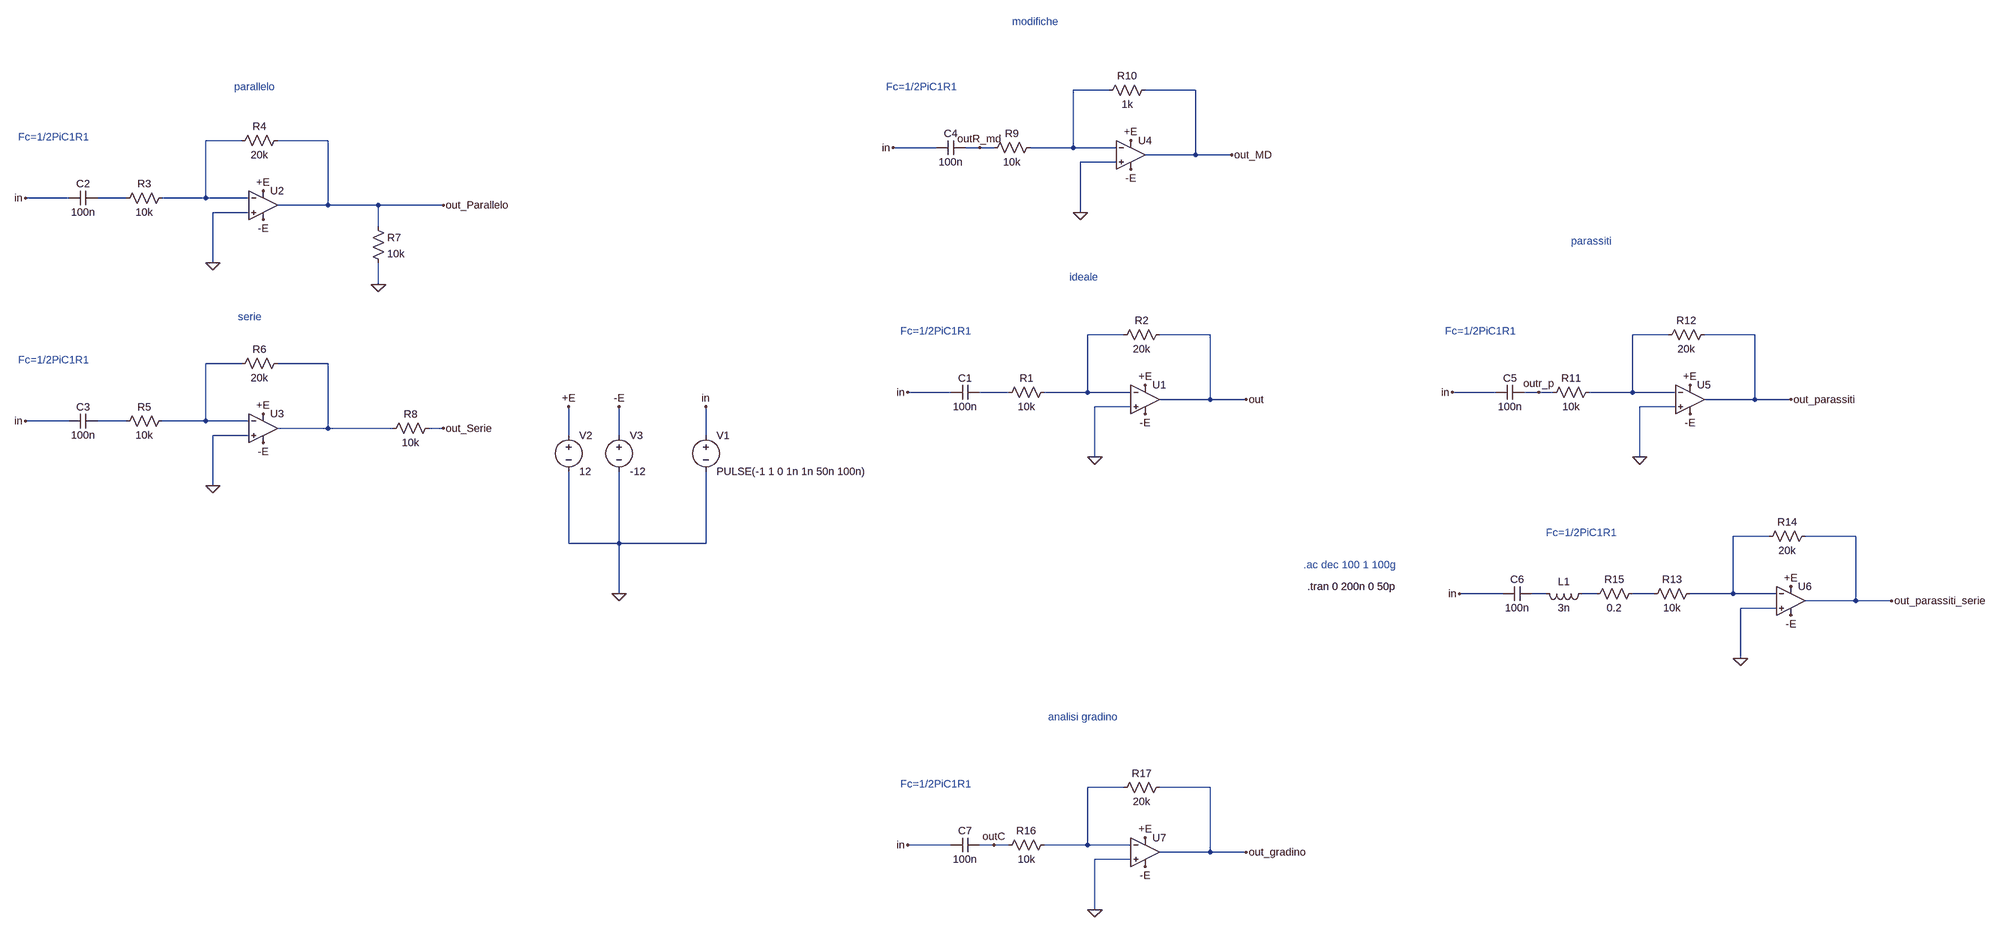
[diagram p0: schematic attivo-ideale.asc]
attivo-ideale.asc, the LTspice schematic file:
Version 4.1
SHEET 1 3920 1460
WIRE 1840 -448 1760 -448
WIRE 2032 -448 1920 -448
WIRE -576 -336 -656 -336
WIRE -384 -336 -496 -336
WIRE 1456 -320 1360 -320
WIRE 1552 -320 1520 -320
WIRE 1584 -320 1552 -320
WIRE 1760 -320 1760 -448
WIRE 1760 -320 1664 -320
WIRE 1856 -320 1760 -320
WIRE 2032 -304 2032 -448
WIRE 2032 -304 1920 -304
WIRE 2112 -304 2032 -304
WIRE 1856 -288 1776 -288
WIRE -960 -208 -1056 -208
WIRE -832 -208 -896 -208
WIRE -656 -208 -656 -336
WIRE -656 -208 -752 -208
WIRE -560 -208 -656 -208
WIRE -384 -192 -384 -336
WIRE -384 -192 -496 -192
WIRE -272 -192 -384 -192
WIRE -128 -192 -272 -192
WIRE -560 -176 -640 -176
WIRE 1776 -176 1776 -288
WIRE -272 -144 -272 -192
WIRE -640 -64 -640 -176
WIRE -272 -16 -272 -64
WIRE 1872 96 1792 96
WIRE 2064 96 1952 96
WIRE 3184 96 3104 96
WIRE 3376 96 3264 96
WIRE -576 160 -656 160
WIRE -384 160 -496 160
WIRE 1488 224 1392 224
WIRE 1616 224 1552 224
WIRE 1792 224 1792 96
WIRE 1792 224 1696 224
WIRE 1888 224 1792 224
WIRE 2800 224 2704 224
WIRE 2896 224 2864 224
WIRE 2928 224 2896 224
WIRE 3104 224 3104 96
WIRE 3104 224 3008 224
WIRE 3200 224 3104 224
WIRE 2064 240 2064 96
WIRE 2064 240 1952 240
WIRE 2144 240 2064 240
WIRE 3376 240 3376 96
WIRE 3376 240 3264 240
WIRE 3456 240 3376 240
WIRE 1888 256 1808 256
WIRE 3200 256 3120 256
WIRE -960 288 -1056 288
WIRE -832 288 -896 288
WIRE -656 288 -656 160
WIRE -656 288 -752 288
WIRE -560 288 -656 288
WIRE -384 304 -384 160
WIRE -384 304 -496 304
WIRE -240 304 -384 304
WIRE -128 304 -160 304
WIRE -560 320 -640 320
WIRE 544 320 544 256
WIRE 656 320 656 256
WIRE 944 320 944 256
WIRE 1808 368 1808 256
WIRE 3120 368 3120 256
WIRE -640 432 -640 320
WIRE 3408 544 3328 544
WIRE 3600 544 3488 544
WIRE 544 560 544 400
WIRE 656 560 656 400
WIRE 656 560 544 560
WIRE 944 560 944 400
WIRE 944 560 656 560
WIRE 656 672 656 560
WIRE 2816 672 2720 672
WIRE 2912 672 2880 672
WIRE 3024 672 2992 672
WIRE 3152 672 3104 672
WIRE 3328 672 3328 544
WIRE 3328 672 3232 672
WIRE 3424 672 3328 672
WIRE 3600 688 3600 544
WIRE 3600 688 3488 688
WIRE 3680 688 3600 688
WIRE 3424 704 3344 704
WIRE 3344 816 3344 704
WIRE 1872 1168 1792 1168
WIRE 2064 1168 1952 1168
WIRE 1488 1296 1392 1296
WIRE 1584 1296 1552 1296
WIRE 1616 1296 1584 1296
WIRE 1792 1296 1792 1168
WIRE 1792 1296 1696 1296
WIRE 1888 1296 1792 1296
WIRE 2064 1312 2064 1168
WIRE 2064 1312 1952 1312
WIRE 2144 1312 2064 1312
WIRE 1888 1328 1808 1328
WIRE 1808 1440 1808 1328
FLAG 544 256 +E
FLAG 656 256 -E
FLAG 944 256 in
FLAG 1808 368 0
FLAG 1920 208 +E
FLAG 1920 272 -E
FLAG 2144 240 out
FLAG 1392 224 in
FLAG 656 672 0
FLAG -640 -64 0
FLAG -528 -224 +E
FLAG -528 -160 -E
FLAG -1056 -208 in
FLAG -640 432 0
FLAG -528 272 +E
FLAG -528 336 -E
FLAG -1056 288 in
FLAG -272 -16 0
FLAG -128 -192 out_Parallelo
FLAG -128 304 out_Serie
FLAG 1776 -176 0
FLAG 1888 -336 +E
FLAG 1888 -272 -E
FLAG 2112 -304 out_MD
FLAG 1360 -320 in
FLAG 3120 368 0
FLAG 3232 208 +E
FLAG 3232 272 -E
FLAG 3456 240 out_parassiti
FLAG 2704 224 in
FLAG 3344 816 0
FLAG 3456 656 +E
FLAG 3456 720 -E
FLAG 3680 688 out_parassiti_serie
FLAG 2720 672 in
FLAG 1808 1440 0
FLAG 1920 1280 +E
FLAG 1920 1344 -E
FLAG 2144 1312 out_gradino
FLAG 1392 1296 in
FLAG 1584 1296 outC
FLAG 1552 -320 outR_md
FLAG 2896 224 outr_p
SYMBOL voltage 544 304 R0
WINDOW 123 0 0 Left 0
WINDOW 39 0 0 Left 0
SYMATTR InstName V2
SYMATTR Value 12
SYMBOL voltage 656 304 R0
WINDOW 123 0 0 Left 0
WINDOW 39 0 0 Left 0
SYMATTR InstName V3
SYMATTR Value -12
SYMBOL cap 1552 208 R90
WINDOW 0 0 32 VBottom 2
WINDOW 3 32 32 VTop 2
SYMATTR InstName C1
SYMATTR Value 100n
SYMBOL res 1712 208 R90
WINDOW 0 0 56 VBottom 2
WINDOW 3 32 56 VTop 2
SYMATTR InstName R1
SYMATTR Value 10k
SYMBOL res 1968 80 R90
WINDOW 0 0 56 VBottom 2
WINDOW 3 32 56 VTop 2
SYMATTR InstName R2
SYMATTR Value 20k
SYMBOL OpAmps\\UniversalOpAmp2 1920 240 R0
SYMATTR InstName U1
SYMATTR Value2 Avol=1t GBW=1000t Slew=1t
SYMATTR SpiceLine Ilimit=10 Rail=0 Vos=0
SYMATTR SpiceLine2 En=0 Enk=0 In=0 Ink=0 Rin=1t
SYMBOL cap -896 -224 R90
WINDOW 0 0 32 VBottom 2
WINDOW 3 32 32 VTop 2
SYMATTR InstName C2
SYMATTR Value 100n
SYMBOL res -736 -224 R90
WINDOW 0 0 56 VBottom 2
WINDOW 3 32 56 VTop 2
SYMATTR InstName R3
SYMATTR Value 10k
SYMBOL res -480 -352 R90
WINDOW 0 0 56 VBottom 2
WINDOW 3 32 56 VTop 2
SYMATTR InstName R4
SYMATTR Value 20k
SYMBOL OpAmps\\UniversalOpAmp2 -528 -192 R0
SYMATTR InstName U2
SYMATTR Value2 Avol=1t GBW=1t Slew=1t
SYMATTR SpiceLine Ilimit=10 Rail=0 Vos=0
SYMATTR SpiceLine2 En=0 Enk=0 In=0 Ink=0 Rin=1t
SYMBOL cap -896 272 R90
WINDOW 0 0 32 VBottom 2
WINDOW 3 32 32 VTop 2
SYMATTR InstName C3
SYMATTR Value 100n
SYMBOL res -736 272 R90
WINDOW 0 0 56 VBottom 2
WINDOW 3 32 56 VTop 2
SYMATTR InstName R5
SYMATTR Value 10k
SYMBOL res -480 144 R90
WINDOW 0 0 56 VBottom 2
WINDOW 3 32 56 VTop 2
SYMATTR InstName R6
SYMATTR Value 20k
SYMBOL OpAmps\\UniversalOpAmp2 -528 304 R0
SYMATTR InstName U3
SYMATTR Value2 Avol=1t GBW=1t Slew=1t
SYMATTR SpiceLine Ilimit=10 Rail=0 Vos=0
SYMATTR SpiceLine2 En=0 Enk=0 In=0 Ink=0 Rin=1t
SYMBOL res -288 -160 R0
SYMATTR InstName R7
SYMATTR Value 10k
SYMBOL res -144 288 R90
WINDOW 0 0 56 VBottom 2
WINDOW 3 32 56 VTop 2
SYMATTR InstName R8
SYMATTR Value 10k
SYMBOL cap 1520 -336 R90
WINDOW 0 0 32 VBottom 2
WINDOW 3 32 32 VTop 2
SYMATTR InstName C4
SYMATTR Value 100n
SYMBOL res 1680 -336 R90
WINDOW 0 0 56 VBottom 2
WINDOW 3 32 56 VTop 2
SYMATTR InstName R9
SYMATTR Value 10k
SYMBOL res 1936 -464 R90
WINDOW 0 0 56 VBottom 2
WINDOW 3 32 56 VTop 2
SYMATTR InstName R10
SYMATTR Value 1k
SYMBOL OpAmps\\UniversalOpAmp2 1888 -304 R0
SYMATTR InstName U4
SYMATTR Value2 Avol=1t GBW=1000t Slew=1t
SYMATTR SpiceLine Ilimit=10 Rail=0 Vos=0
SYMATTR SpiceLine2 En=0 Enk=0 In=0 Ink=0 Rin=1t
SYMBOL cap 2864 208 R90
WINDOW 0 0 32 VBottom 2
WINDOW 3 32 32 VTop 2
SYMATTR InstName C5
SYMATTR Value 100n
SYMATTR SpiceLine V=0 Irms=0 Rser=0.2 Lser=3n Rpar=0 Cpar=0
SYMBOL res 3024 208 R90
WINDOW 0 0 56 VBottom 2
WINDOW 3 32 56 VTop 2
SYMATTR InstName R11
SYMATTR Value 10k
SYMBOL res 3280 80 R90
WINDOW 0 0 56 VBottom 2
WINDOW 3 32 56 VTop 2
SYMATTR InstName R12
SYMATTR Value 20k
SYMBOL OpAmps\\UniversalOpAmp2 3232 240 R0
SYMATTR InstName U5
SYMATTR Value2 Avol=1t GBW=1000t Slew=1t
SYMATTR SpiceLine Ilimit=10 Rail=0 Vos=0
SYMATTR SpiceLine2 En=0 Enk=0 In=0 Ink=0 Rin=1t
SYMBOL cap 2880 656 R90
WINDOW 0 0 32 VBottom 2
WINDOW 3 32 32 VTop 2
SYMATTR InstName C6
SYMATTR Value 100n
SYMATTR SpiceLine V=0 Irms=0 Rser=0 Lser=0 Rpar=0 Cpar=0
SYMBOL res 3248 656 R90
WINDOW 0 0 56 VBottom 2
WINDOW 3 32 56 VTop 2
SYMATTR InstName R13
SYMATTR Value 10k
SYMBOL res 3504 528 R90
WINDOW 0 0 56 VBottom 2
WINDOW 3 32 56 VTop 2
SYMATTR InstName R14
SYMATTR Value 20k
SYMBOL OpAmps\\UniversalOpAmp2 3456 688 R0
SYMATTR InstName U6
SYMATTR Value2 Avol=1t GBW=1000t Slew=1t
SYMATTR SpiceLine Ilimit=10 Rail=0 Vos=0
SYMATTR SpiceLine2 En=0 Enk=0 In=0 Ink=0 Rin=1t
SYMBOL ind 3008 656 R90
WINDOW 0 5 56 VBottom 2
WINDOW 3 32 56 VTop 2
SYMATTR InstName L1
SYMATTR Value 3n
SYMATTR SpiceLine Rser=1m
SYMBOL res 3120 656 R90
WINDOW 0 0 56 VBottom 2
WINDOW 3 32 56 VTop 2
SYMATTR InstName R15
SYMATTR Value 0.2
SYMBOL voltage 944 304 R0
WINDOW 123 0 0 Left 0
WINDOW 39 0 0 Left 0
SYMATTR InstName V1
SYMATTR Value PULSE(-1 1 0 1n 1n 50n 100n)
SYMBOL cap 1552 1280 R90
WINDOW 0 0 32 VBottom 2
WINDOW 3 32 32 VTop 2
SYMATTR InstName C7
SYMATTR Value 100n
SYMBOL res 1712 1280 R90
WINDOW 0 0 56 VBottom 2
WINDOW 3 32 56 VTop 2
SYMATTR InstName R16
SYMATTR Value 10k
SYMBOL res 1968 1152 R90
WINDOW 0 0 56 VBottom 2
WINDOW 3 32 56 VTop 2
SYMATTR InstName R17
SYMATTR Value 20k
SYMBOL OpAmps\\UniversalOpAmp2 1920 1312 R0
SYMATTR InstName U7
SYMATTR Value2 Avol=1t GBW=1000t Slew=1t
SYMATTR SpiceLine Ilimit=10 Rail=0 Vos=0
SYMATTR SpiceLine2 En=0 Enk=0 In=0 Ink=0 Rin=1t
TEXT 1376 88 Left 2 ;Fc=1/2PiC1R1
TEXT 2272 608 Left 2 ;.ac dec 100 1 100g
TEXT 2280 656 Left 2 !.tran 0 200n 0 50p
TEXT -1072 -344 Left 2 ;Fc=1/2PiC1R1
TEXT -1072 152 Left 2 ;Fc=1/2PiC1R1
TEXT 1344 -456 Left 2 ;Fc=1/2PiC1R1
TEXT -592 -456 Left 2 ;parallelo
TEXT -584 56 Left 2 ;serie
TEXT 1624 -616 Left 2 ;modifiche
TEXT 2688 88 Left 2 ;Fc=1/2PiC1R1
TEXT 2968 -112 Left 2 ;parassiti
TEXT 2912 536 Left 2 ;Fc=1/2PiC1R1
TEXT 1752 -32 Left 2 ;ideale
TEXT 1376 1160 Left 2 ;Fc=1/2PiC1R1
TEXT 1704 976 Left 2 ;analisi gradino

The netlist it stands for:
* attivo-ideale.asc
V2 +E 0 12
V3 -E 0 -12
C1 N008 in 100n
R1 N004 N008 10k
R2 out N004 20k
X§U1 0 N004 +E -E out level2 Avol=1t GBW=1000t Slew=1t Ilimit=10 Rail=0 Vos=0 En=0 Enk=0 In=0 Ink=0 Rin=1t  ; pins In+ In- V+ V- OUT
C2 N003 in 100n
R3 N002 N003 10k
R4 out_Parallelo N002 20k
X§U2 0 N002 +E -E out_Parallelo level2 Avol=1t GBW=1t Slew=1t Ilimit=10 Rail=0 Vos=0 En=0 Enk=0 In=0 Ink=0 Rin=1t  ; pins In+ In- V+ V- OUT
C3 N009 in 100n
R5 N006 N009 10k
R6 N007 N006 20k
X§U3 0 N006 +E -E N007 level2 Avol=1t GBW=1t Slew=1t Ilimit=10 Rail=0 Vos=0 En=0 Enk=0 In=0 Ink=0 Rin=1t  ; pins In+ In- V+ V- OUT
R7 out_Parallelo 0 10k
R8 out_Serie N007 10k
C4 outR_md in 100n
R9 N001 outR_md 10k
R10 out_MD N001 1k
X§U4 0 N001 +E -E out_MD level2 Avol=1t GBW=1000t Slew=1t Ilimit=10 Rail=0 Vos=0 En=0 Enk=0 In=0 Ink=0 Rin=1t  ; pins In+ In- V+ V- OUT
C5 outr_p in 100n V=0 Irms=0 Rser=0.2 Lser=3n Rpar=0 Cpar=0
R11 N005 outr_p 10k
R12 out_parassiti N005 20k
X§U5 0 N005 +E -E out_parassiti level2 Avol=1t GBW=1000t Slew=1t Ilimit=10 Rail=0 Vos=0 En=0 Enk=0 In=0 Ink=0 Rin=1t  ; pins In+ In- V+ V- OUT
C6 N011 in 100n V=0 Irms=0 Rser=0 Lser=0 Rpar=0 Cpar=0
R13 N010 N013 10k
R14 out_parassiti_serie N010 20k
X§U6 0 N010 +E -E out_parassiti_serie level2 Avol=1t GBW=1000t Slew=1t Ilimit=10 Rail=0 Vos=0 En=0 Enk=0 In=0 Ink=0 Rin=1t  ; pins In+ In- V+ V- OUT
L1 N012 N011 3n Rser=1m
R15 N013 N012 0.2
V1 in 0 PULSE(-1 1 0 1n 1n 50n 100n)
C7 outC in 100n
R16 N014 outC 10k
R17 out_gradino N014 20k
X§U7 0 N014 +E -E out_gradino level2 Avol=1t GBW=1000t Slew=1t Ilimit=10 Rail=0 Vos=0 En=0 Enk=0 In=0 Ink=0 Rin=1t  ; pins In+ In- V+ V- OUT
* Fc=1/2PiC1R1
* .ac dec 100 1 100g
.tran 0 200n 0 50p
* Fc=1/2PiC1R1
* Fc=1/2PiC1R1
* Fc=1/2PiC1R1
* parallelo
* serie
* modifiche
* Fc=1/2PiC1R1
* parassiti
* Fc=1/2PiC1R1
* ideale
* Fc=1/2PiC1R1
* analisi gradino
.lib UniversalOpAmp2.lib
.backanno
.end